# EAGLE design keyer (EAGLE 6.1)
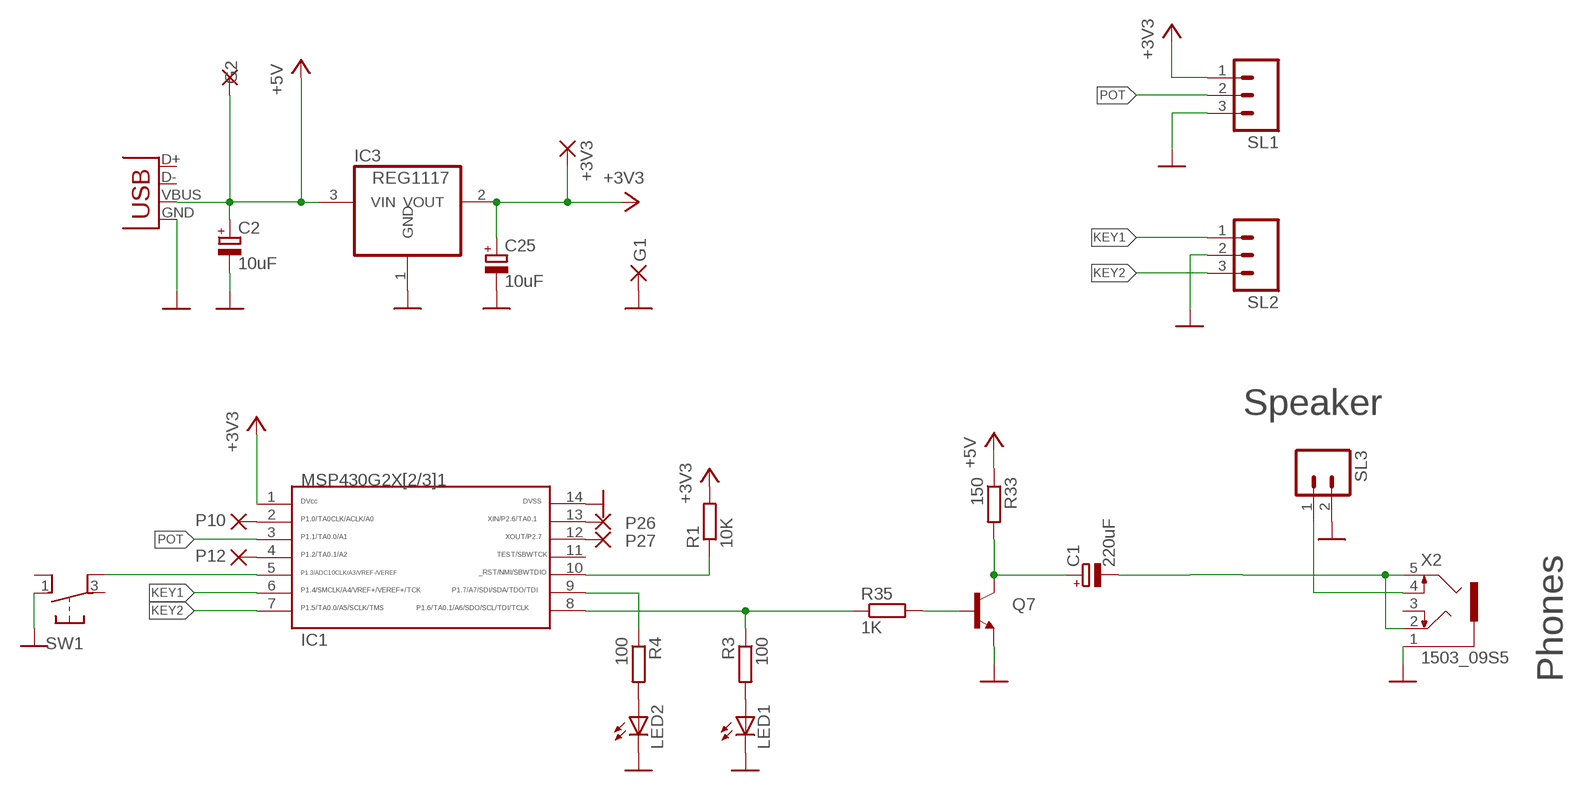
[diagram p0: schematic, sheet 1]

## Parts
100  R3  R-EU_R0805S  [R0805-SVO]
+3V3  1,6/0,8  [1,6/0,8]
C1  220uF  CPOL-EUD/7343-31R  [D/7343-31R]
C2  10uF  CPOL-EUSMCB  [SMC_B]
C25  10uF  CPOL-EUSMCB  [SMC_B]
G1  1,6/0,8  [1,6/0,8]
G2  1,6/0,8  [1,6/0,8]
IC1  G2X[2/3]1---N14  [N14]
IC3  REG1117  [SOT223]
LED1  LED3MM  [LED3MM]
LED2  LED3MM  [LED3MM]
P10  1,6/0,8  [1,6/0,8]
P12  1,6/0,8  [1,6/0,8]
P26  1,6/0,8  [1,6/0,8]
P27  1,6/0,8  [1,6/0,8]
Q7  TRANSISTOR_NPNSOT23-3  [SOT23-3]
R1  10K  R-EU_R0805S  [R0805-SVO]
R4  100  R-EU_R0805S  [R0805-SVO]
R33  150  R-EU_R0805S  [R0805-SVO]
R35  1K  R-EU_R0805S  [R0805-SVO]
SL1  M03  [03P]
SL2  M03  [03P]
SL3  M02  [02P]
SW1  BUTTON_6X6_THRU  [6X6_BUTTON_THRU]
X1  USB-MICROB  [USB-MICROB]
X2  1503_09S5  [SYMMETRON5]

## Nets
+3V3: +3V3.1(P) C25.+ IC1.1 IC3.2(VOUT) R1.2 SL1.1
+5V: C2.+ G2.1(P) IC3.3(VIN) R33.1 X1.VBUS
GATE [hv800]: C1.- X2.2 X2.5
GND: C2.- C25.- G1.1(P) IC1.14 IC3.1(GND) LED1.K(C) LED2.K(C) Q7.2(E) SL1.3 SL2.2 SL3.2 SW1.1(P2) X1.GND X2.1
KEY1: IC1.6 SL2.1
KEY2: IC1.7 SL2.3
MODE1: IC1.5 SW1.4(P1)
N$1: IC1.10 R1.1
N$2: 100.2 LED1.A
N$4: IC1.2 P10.1(P)
N$5: LED2.A R4.2
N$6: IC1.9 R4.1
N$7: 100.1 IC1.8 R35.1
N$8: IC1.4 P12.1(P)
N$9: IC1.12 P27.1(P)
N$10: IC1.13 P26.1(P)
N$34 [hv250]: C1.+ Q7.3(C) R33.2
N$38: SL3.1 X2.4
POT: IC1.3 SL1.2
ZDACN$36: Q7.1(B) R35.2
Unconnected: IC1.11 SW1.2 SW1.3(P1) X1.D+ X1.D- X2.3

## Notes on the sheet
- Speaker
- Phones

## Library data of the parts
100 R1 R4 R33 R35 = rcl:R-EU_: RESISTOR, European symbol
+3V3 G1 G2 P10 P12 P26 P27 = wirepad:1,6/0,8: THROUGH-HOLE PAD
C1 C2 C25 = rcl:CPOL-EU: POLARIZED CAPACITOR, European symbol
IC1 = TI_MSP430_v16:G2X[2/3]1---N14: MSP430G2X[2/3]1 PDIP (N) 14 Pin Package http://focus.ti.com/docs/prod/folders/print/msp430g2221.html MSP430G2121, MSP430G2221, MSP430G2131
IC3 = burr-brown:REG1117: 800mA and 1A Low Dropout (LDO) Positive Regulator 1.8V, 2.5V, 2.85V, 3.3V, 5V, and Adj; MPN: REG1117; OC_FARNELL: 1097566; OC_NEWARK: 14P6981
LED1 LED2 = 0-svo:LED: LED OSRAM: - CHIPLED LG R971, LG N971, LY N971, LG Q971, LY Q971, LO R971, LY R971 LH N974, LH R974 LS Q976, LO Q976, LY Q976 LO Q996 - Hyper CHIPLED LW Q18S LB Q993, LB Q99A, LB R99A - SideLED LS A670, LO A670, LY A670, LG A670, LP A670 LB A673, LV A673, LT A673, LW A673 LH A674 LY A675 LS A676, LA A676, LO A676, LY A676, LW A676 LS A679, LY A679, LG A679 - Hyper Micro SIDELED® LS Y876, LA Y876, LO Y876, LY Y876 LT Y87S - SmartLED LW L88C, LW L88S LB L89C, LB L89S, LG L890 LS L89K, LO L89K, LY L89K LS L896, LA L896, LO L896, LY L896 - TOPLED LS T670, LO T670, LY T670, LG T670, LP T670 LSG T670, LSP T670, LSY T670, LOP T670, LYG T670 LG T671, LOG T671, LSG T671 LB T673, LV T673, LT T673, LW T673 LH T674 LS T676, LA T676, LO T676, LY T676, LB T676, LH T676, LSB T676, LW T676 LB T67C, LV T67C, LT T67C, LS T67K, LO T67K, LY T67K, LW E67C LS E67B, LA E67B, LO E67B, LY E67B, LB E67C, LV E67C, LT E67C LW T67C LS T679, LY T679, LG T679 LS T770, LO T770, LY T770, LG T770, LP T770 LB T773, LV T773, LT T773, LW T773 LH T774 LS E675, LA E675, LY E675, LS T675 LS T776, LA T776, LO T776, LY T776, LB T776 LHGB T686 LT T68C, LB T68C - Hyper Mini TOPLED® LB M676 - Mini TOPLED Santana® LG M470 LS M47K, LO M47K, LY M47K Source: http://www.osram.convergy.de/
Q7 = SparkFun:TRANSISTOR_NPN: Transistor NPN BJT configuration in SOT23 package. MMBT2222 is the common NPN we use. Double check BCE configuration again layout.
SL1 SL2 = con-amp-quick:M03: AMP QUICK CONNECTOR; OC_FARNELL: unknown; OC_NEWARK: unknown
SL3 = con-amp-quick:M02: AMP QUICK CONNECTOR
SW1 = 0-svo:BUTTON_6X6_*
X1 = SparkFun:USB: USB Connectors USB-B-PTH is fully proven SKU : PRT-00139 USB-miniB is fully proven SKU : PRT-00587 USB-A-PCB is untested. USB-A-H is throughly reviewed, but untested. Spark Fun Electronics SKU : PRT-00437 USB-B-SMT is throughly reviewed, but untested. Needs silkscreen touching up. USB-A-S has not been used/tested USB-MB-H has not been used/tested
X2 = 0-svo-jacks:1503_09: Jack connectors according to JISC 6560, 3.5 mm Klinkeneinbaukupplung nach JISC 6560, 3,5 mm, 3-polig/ stereo, abgewinkelte Ausführung, mit 2 Öffnern und Lötaugen, für Leiterplatten Rückseitenmontage Source: http://www.lumberg.com/Produkte/PDFs/1503_09.pdf

## Net classes
3 hv250: width 0.25 mm, clearance 0.45 mm
4 hv800: width 0.25 mm, clearance 0.65 mm

## Board
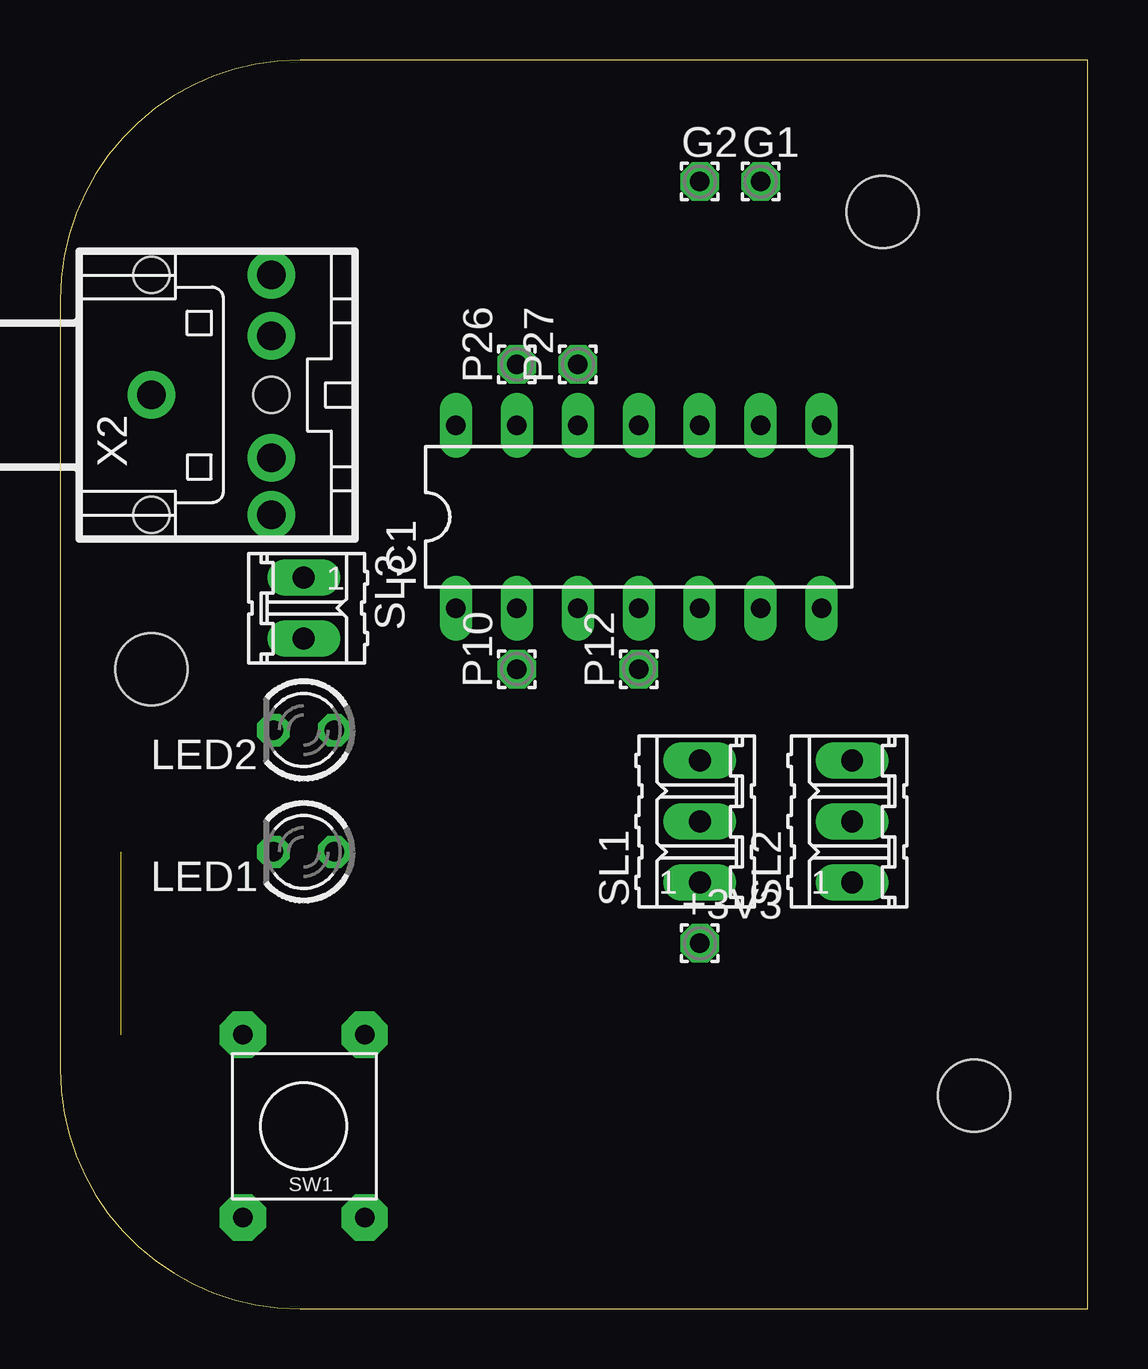
[diagram p1: board, top side]
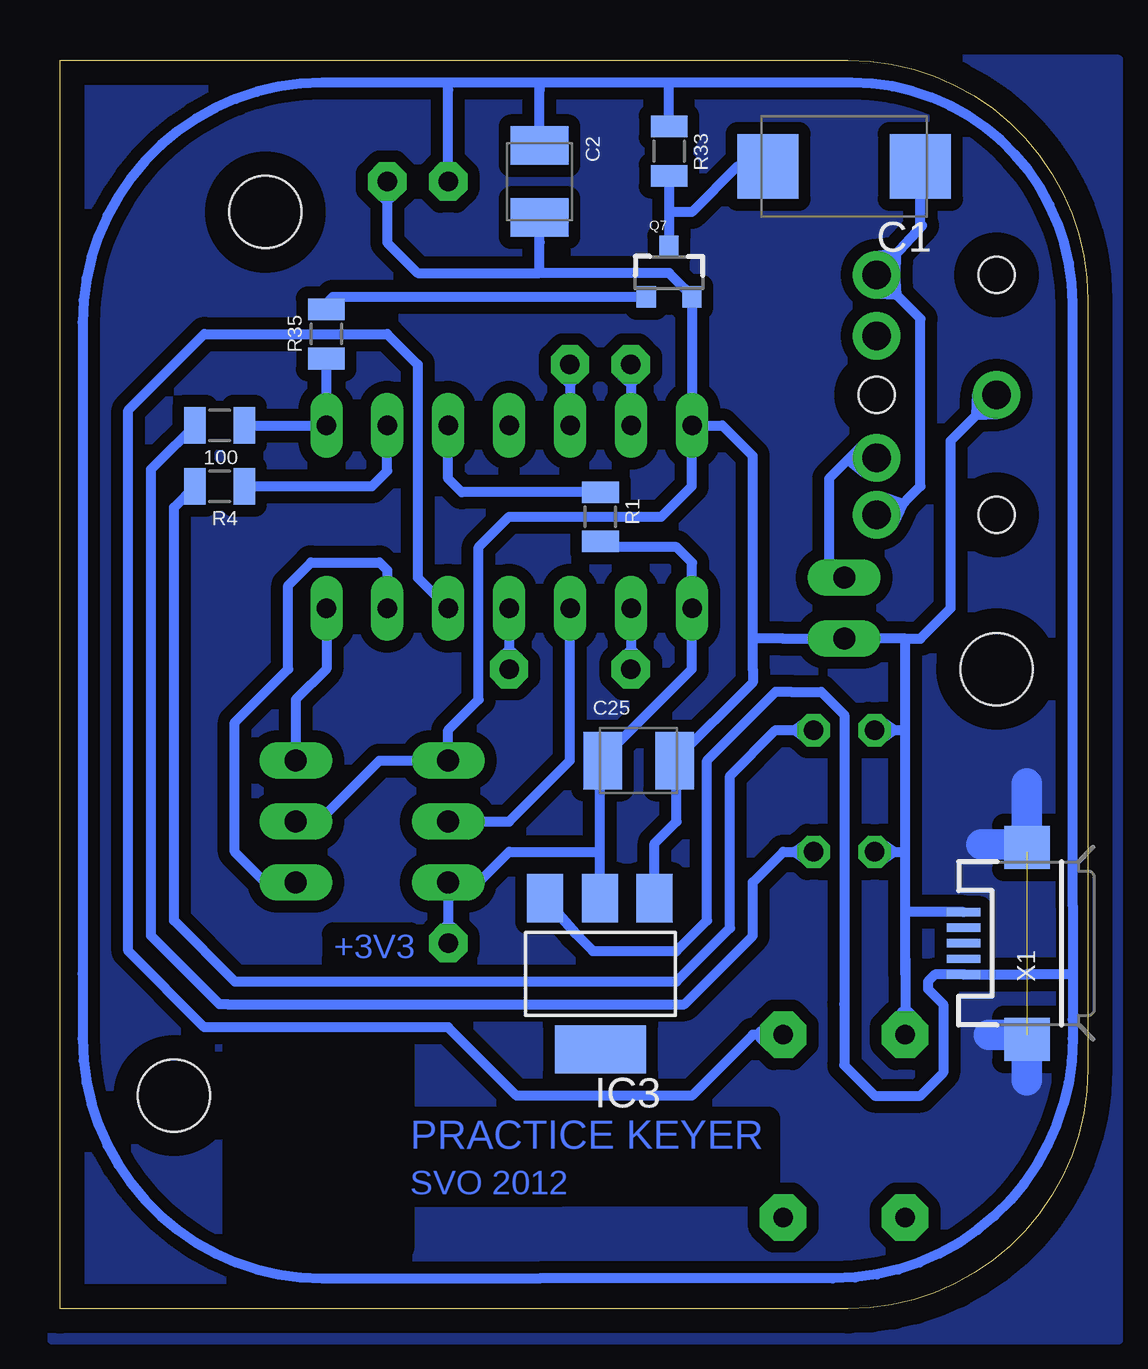
[diagram p2: board, bottom side, seen from below]

Size 42.85 x 52.06 mm. Coordinates in mm from the lower left corner, seen from the top.
Outline: 0,42.06 0,10 arc90 10,0 42.85,0 42.85,52.06 10,52.06 arc90 0,42.06
Copper layers (1*16): Top 0.035mm / dielectric 1.5mm / Bottom 0.035mm
Design rules: minimum track width 10mil, minimum drill 24mil, track to track 8mil, track to pad 8mil, pad to pad 8mil, via to via 8mil, smd to smd 8mil, copper to edge 40mil, drill to drill 8mil, minimum pad ring 10mil, minimum via ring 8mil, stop-mask expansion 4mil, vias tented up to drill 0mil, thermal gap 10mil
Holes 3 mm at 3.81,26.67 38.1,8.89 34.29,45.72
bRestrict: area 13.3,4.8 to 28.3,7.9; area 28.6,2.5 to 35.6,10.8

### Footprints (pad centres in the part's own frame; a part is rotated, then mirrored left to right if it is on the bottom)
R0805-SVO = smd 0.9 x 1.524: 1 -1.027,0; 2 1.027,0
1,6/0,8 = drill 0.813 pad 1.6 octagon: 1 0,0
D/7343-31R = smd 2.55 x 2.7: + 3.175,0; - -3.175,0
SMC_B = smd 1.6 x 2.4: + -1.5,0; - 1.5,0
N14 = drill 0.813 long: 1 -7.625,-3.81; 2 -5.085,-3.81; 3 -2.545,-3.81; 4 -0.005,-3.81; 5 2.535,-3.81; 6 5.075,-3.81; 7 7.615,-3.81; 8 7.615,3.81; 9 5.075,3.81; 10 2.535,3.81; 11 -0.005,3.81; 12 -2.545,3.81; 13 -5.085,3.81; 14 -7.625,3.81
SOT223 = smd 1.499 x 2.007: 1 -2.261,-3.15; 2 0.025,-3.15; 3 2.311,-3.15 | smd 3.81 x 2.007: 4 0,3.15
LED3MM = drill 0.813 octagon: A -1.27,0; K 1.27,0
SOT23-3 = smd 0.8 x 0.9: 1 -0.95,-1; 2 0.95,-1; 3 0,1.1
03P = drill 0.914 long: 1 -2.54,0; 2 0,0; 3 2.54,0
02P = drill 0.914 long: 1 -1.27,0; 2 1.27,0
6X6_BUTTON_THRU = drill 0.813 pad 1.93 octagon: 1 -2.54,3.81; 2 -2.54,-3.81; 3 2.54,-3.81; 4 2.54,3.81
USB-MICROB = smd 0.35 x 1.4: D+ 0,2.65; D- -0.65,2.65; GND 1.3,2.65; ID 0.65,2.65; VBUS -1.3,2.65 | smd 1.8 x 1.9: MT1 -4,0; MT2 4,0
SYMMETRON5 = drill 1.2: 1 -2.54,0; 2 2.46,5; 3 2.46,2.46; 4 2.46,-2.62; 5 2.46,-5 | hole 1.5: -2.54,-5; 2.46,0; -2.54,5

### Placement (x,y rotation side)
100  36.2,36.83 180 bottom
+3V3  26.67,15.24 0 top
C1  10.16,47.62 180 bottom
C2  22.86,46.99 270 bottom
C25  18.73,22.86 0 bottom
G1  29.21,46.99 0 top
G2  26.67,46.99 0 top
IC1  24.13,33.02 0 top
IC3  20.32,13.97 180 bottom
LED1  10.16,19.05 180 top
LED2  10.16,24.13 180 top
P10  19.05,26.67 90 top
P12  24.13,26.67 90 top
P26  19.05,39.37 90 top
P27  21.59,39.37 90 top
Q7  17.46,43.18 0 bottom
R1  20.32,33.02 270 bottom
R4  36.2,34.29 180 bottom
R33  17.46,48.26 270 bottom
R35  31.75,40.64 90 bottom
SL1  26.67,20.32 90 top
SL2  33.02,20.32 90 top
SL3  10.16,29.21 270 top
SW1  10.16,7.62 0 top
X1  2.54,15.24 90 bottom
X2  6.35,38.1 0 top

### Tracks (layer width: path | path; a pad name or v marks a point on that pad's centre or on a via)
+3V3
  Bottom 0.406: R1.2 20.08,31.75 17.14,31.75 16.5,31.11 IC1.1 16.51,26.67 20.23,22.95 C25.+ 20.34,22.75 20.34,19.05 | IC3.2 20.34,19.05 | 20.34,19.05 24.13,19.05 25.4,17.78 SL1.1 +3V3.1 | +3V3.1 26.27,15.68 26.67,16.05 27.07,15.68 +3V3.1
+5V
  Bottom 0.406: X1.VBUS 5.11,13.94 | 5.11,13.94 3.52,13.94 | 17.46,51.12 9.84,51.12 arc90 0.64,41.91 0.64,16.83 0.64,13.97 | 17.46,51.12 17.78,51.12 | 17.78,51.12 22.86,51.12 | X1.VBUS 5.11,13.94 | 5.11,13.94 2.51,13.94 arc90 2.48,13.97 0.64,13.97 | R33.1 17.46,51.12 | 17.46,51.12 17.78,51.12 | C2.+ 22.86,50.8 | 22.86,50.8 22.86,51.12 | 22.86,51.12 22.86,50.8 | IC3.3 21.36,15.65 20.64,14.92 17.14,14.92 15.88,16.19 15.88,22.86 13.02,25.72 12.38,25.72 11.11,25.72 10.16,24.77 10.16,12.7 10.16,10.16 8.89,8.89 6.99,8.89 6.03,9.84 6.03,12.7 6.67,13.34 6.67,13.65 6.38,13.94 5.11,13.94 | X1.VBUS 5.11,13.94 | 22.86,51.12 26.67,51.12 | 26.67,51.12 31.91,51.12 arc-90 41.91,41.12 41.91,13.97 41.91,11.27 arc-90 31.91,1.27 22.86,1.27 10.63,1.27 arc-90 0.64,11.27 0.64,12.06 0.64,13.97 | G2.1 26.67,50.8 26.67,51.12
GATE
  Bottom 0.406: X2.5 8.18,33.1 6.99,34.29 6.99,41.27 X2.2 | X2.2 8.89,43.18 X2.2 | X2.2 6.91,45.16 6.99,45.09 C1.- | X2.5 8.1,32.76 7.71,33.57 8.56,33.85 X2.5 | X2.2 8.86,42.31 7.96,42.25 8.02,43.15 X2.2 | X2.2 8.02,43.08 8,43.98 8.89,43.89 X2.2
GND
  Bottom 0.406: 7.62,27.94 SL3.2 12.7,27.94 13.97,27.94 | 7.62,27.94 6.99,27.94 5.71,29.21 5.71,36.2 X2.1 | IC1.14 15.24,36.83 13.97,35.56 13.97,27.94 | 22.86,43.18 17.46,43.18 16.83,42.55 Q7.2 16.51,36.83 IC1.14 | 22.86,43.18 22.86,44.45 C2.- | 7.62,19.05 7.62,24.13 | 7.62,24.13 7.62,27.94 | LED2.K 7.62,24.13 | LED1.K 7.62,19.05 | IC1.14 16.51,34.29 17.78,33.02 24.13,33.02 25.4,31.75 25.4,25.4 26.67,24.13 SL1.3 29.53,22.86 32.07,20.32 SL2.2 | 7.62,13.97 7.62,14.61 | 7.62,14.61 7.62,16.51 7.62,16.83 | 7.62,16.83 7.62,19.05 | 7.62,13.97 SW1.1 | 13.97,27.94 13.97,26.67 13.97,26.12 C25.- 17.14,22.77 17.14,20.32 18.06,19.41 IC3.1 | 7.62,14.61 7.62,13.97 | G1.1 29.21,44.45 27.94,43.18 22.86,43.18 | LED1.K 8.62,18.67 8.08,19.05 8.62,19.43 LED1.K | X2.1 4.6,38.15 4.66,37.25 3.76,37.31 X2.1 | LED2.K 8.62,23.75 8.08,24.13 8.62,24.51 LED2.K | G1.1 29.61,46.55 29.21,46.18 28.8,46.55 G1.1 | X1.GND 7.62,16.54 7.62,16.83
  Bottom 0.813: 7.62,12.24 7.21,11.81 SW1.1 8.03,11.81 7.62,12.24
KEY1
  Bottom 0.406: SL2.1 34.29,17.78 35.56,19.05 35.56,24.45 33.34,26.67 33.34,30.16 32.38,31.11 29.53,31.11 29.21,30.8 IC1.6
KEY2
  Bottom 0.406: IC1.7 31.75,26.68 33.02,25.4 SL2.3
MODE1
  Bottom 0.406: SW1.4 13.97,11.43 16.51,8.89 23.81,8.89 26.67,11.75 36.83,11.75 40.01,14.92 40.01,37.47 36.83,40.64 29.21,40.64 27.94,39.37 27.94,30.48 IC1.5
  Bottom 0.813: 13.51,11.43 13.08,11.84 SW1.4 13.08,11.02 13.51,11.43
N$1
  Bottom 0.406: R1.1 26.11,34.05 26.67,34.61 IC1.10
N$2
  Bottom 0.406: 100.2 38.77,35.28 39.05,35 39.05,15.56 36.2,12.7 35.88,12.7 16.83,12.7 13.97,15.56 13.97,17.78 12.7,19.05 LED1.A | LED1.A 11.7,19.43 12.24,19.05 11.7,18.67 LED1.A
N$3  (1 unrouted)
  Bottom 1.27: 2.54,19.05 2.54,19.37 | 2.54,19.37 2.54,21.91 | 2.54,19.37 4.45,19.37 | 2.54,9.53 2.54,11.43 4.13,11.43
  pour Bottom (isolate 0.5): -1.27,52.07 43.18,52.07 43.18,-1.27 -1.27,-1.27
N$4
  Bottom 0.406: IC1.2 P10.1 | P10.1 18.64,27.11 19.05,27.48 19.45,27.11 P10.1
N$5
  Bottom 0.406: R4.2 38.1,33.41 38.1,16.19 35.56,13.65 17.14,13.65 14.92,15.88 14.92,22.23 13.02,24.13 LED2.A | LED2.A 11.7,24.51 12.24,24.13 11.7,23.75 LED2.A
N$6
  Bottom 0.406: R4.1 29.84,34.29 29.21,34.92 IC1.9
N$7
  Bottom 0.406: R35.1 IC1.8 100.1
N$8
  Bottom 0.406: IC1.4 P12.1 | P12.1 23.72,27.11 24.12,27.48 24.53,27.11 P12.1
N$9
  Bottom 0.406: P27.1 IC1.12 | P27.1 22,38.93 21.59,38.56 21.18,38.93 P27.1
N$10
  Bottom 0.406: P26.1 IC1.13 | P26.1 19.45,38.93 19.05,38.56 18.64,38.93 P26.1
N$34
  Bottom 0.406: R33.2 17.46,45.72 | 17.46,45.72 Q7.3 | C1.+ 14.61,47.62 16.51,45.72 17.46,45.72
N$38
  Bottom 0.406: X2.4 9.92,35.48 10.79,34.61 10.79,31.11 SL3.1 | X2.4 9.37,36.04 10.01,35.4 9.29,34.85 X2.4
POT
  Bottom 0.406: SL1.2 24.13,20.32 21.59,22.86 IC1.3
ZDACN$36
  Bottom 0.406: Q7.1 31.48,42.18 31.75,41.91 R35.2

### Text on the board
Bottom: +3V3 | PRACTICE KEYER | SVO 2012